# Altium project INA219_shield.PrjPcb
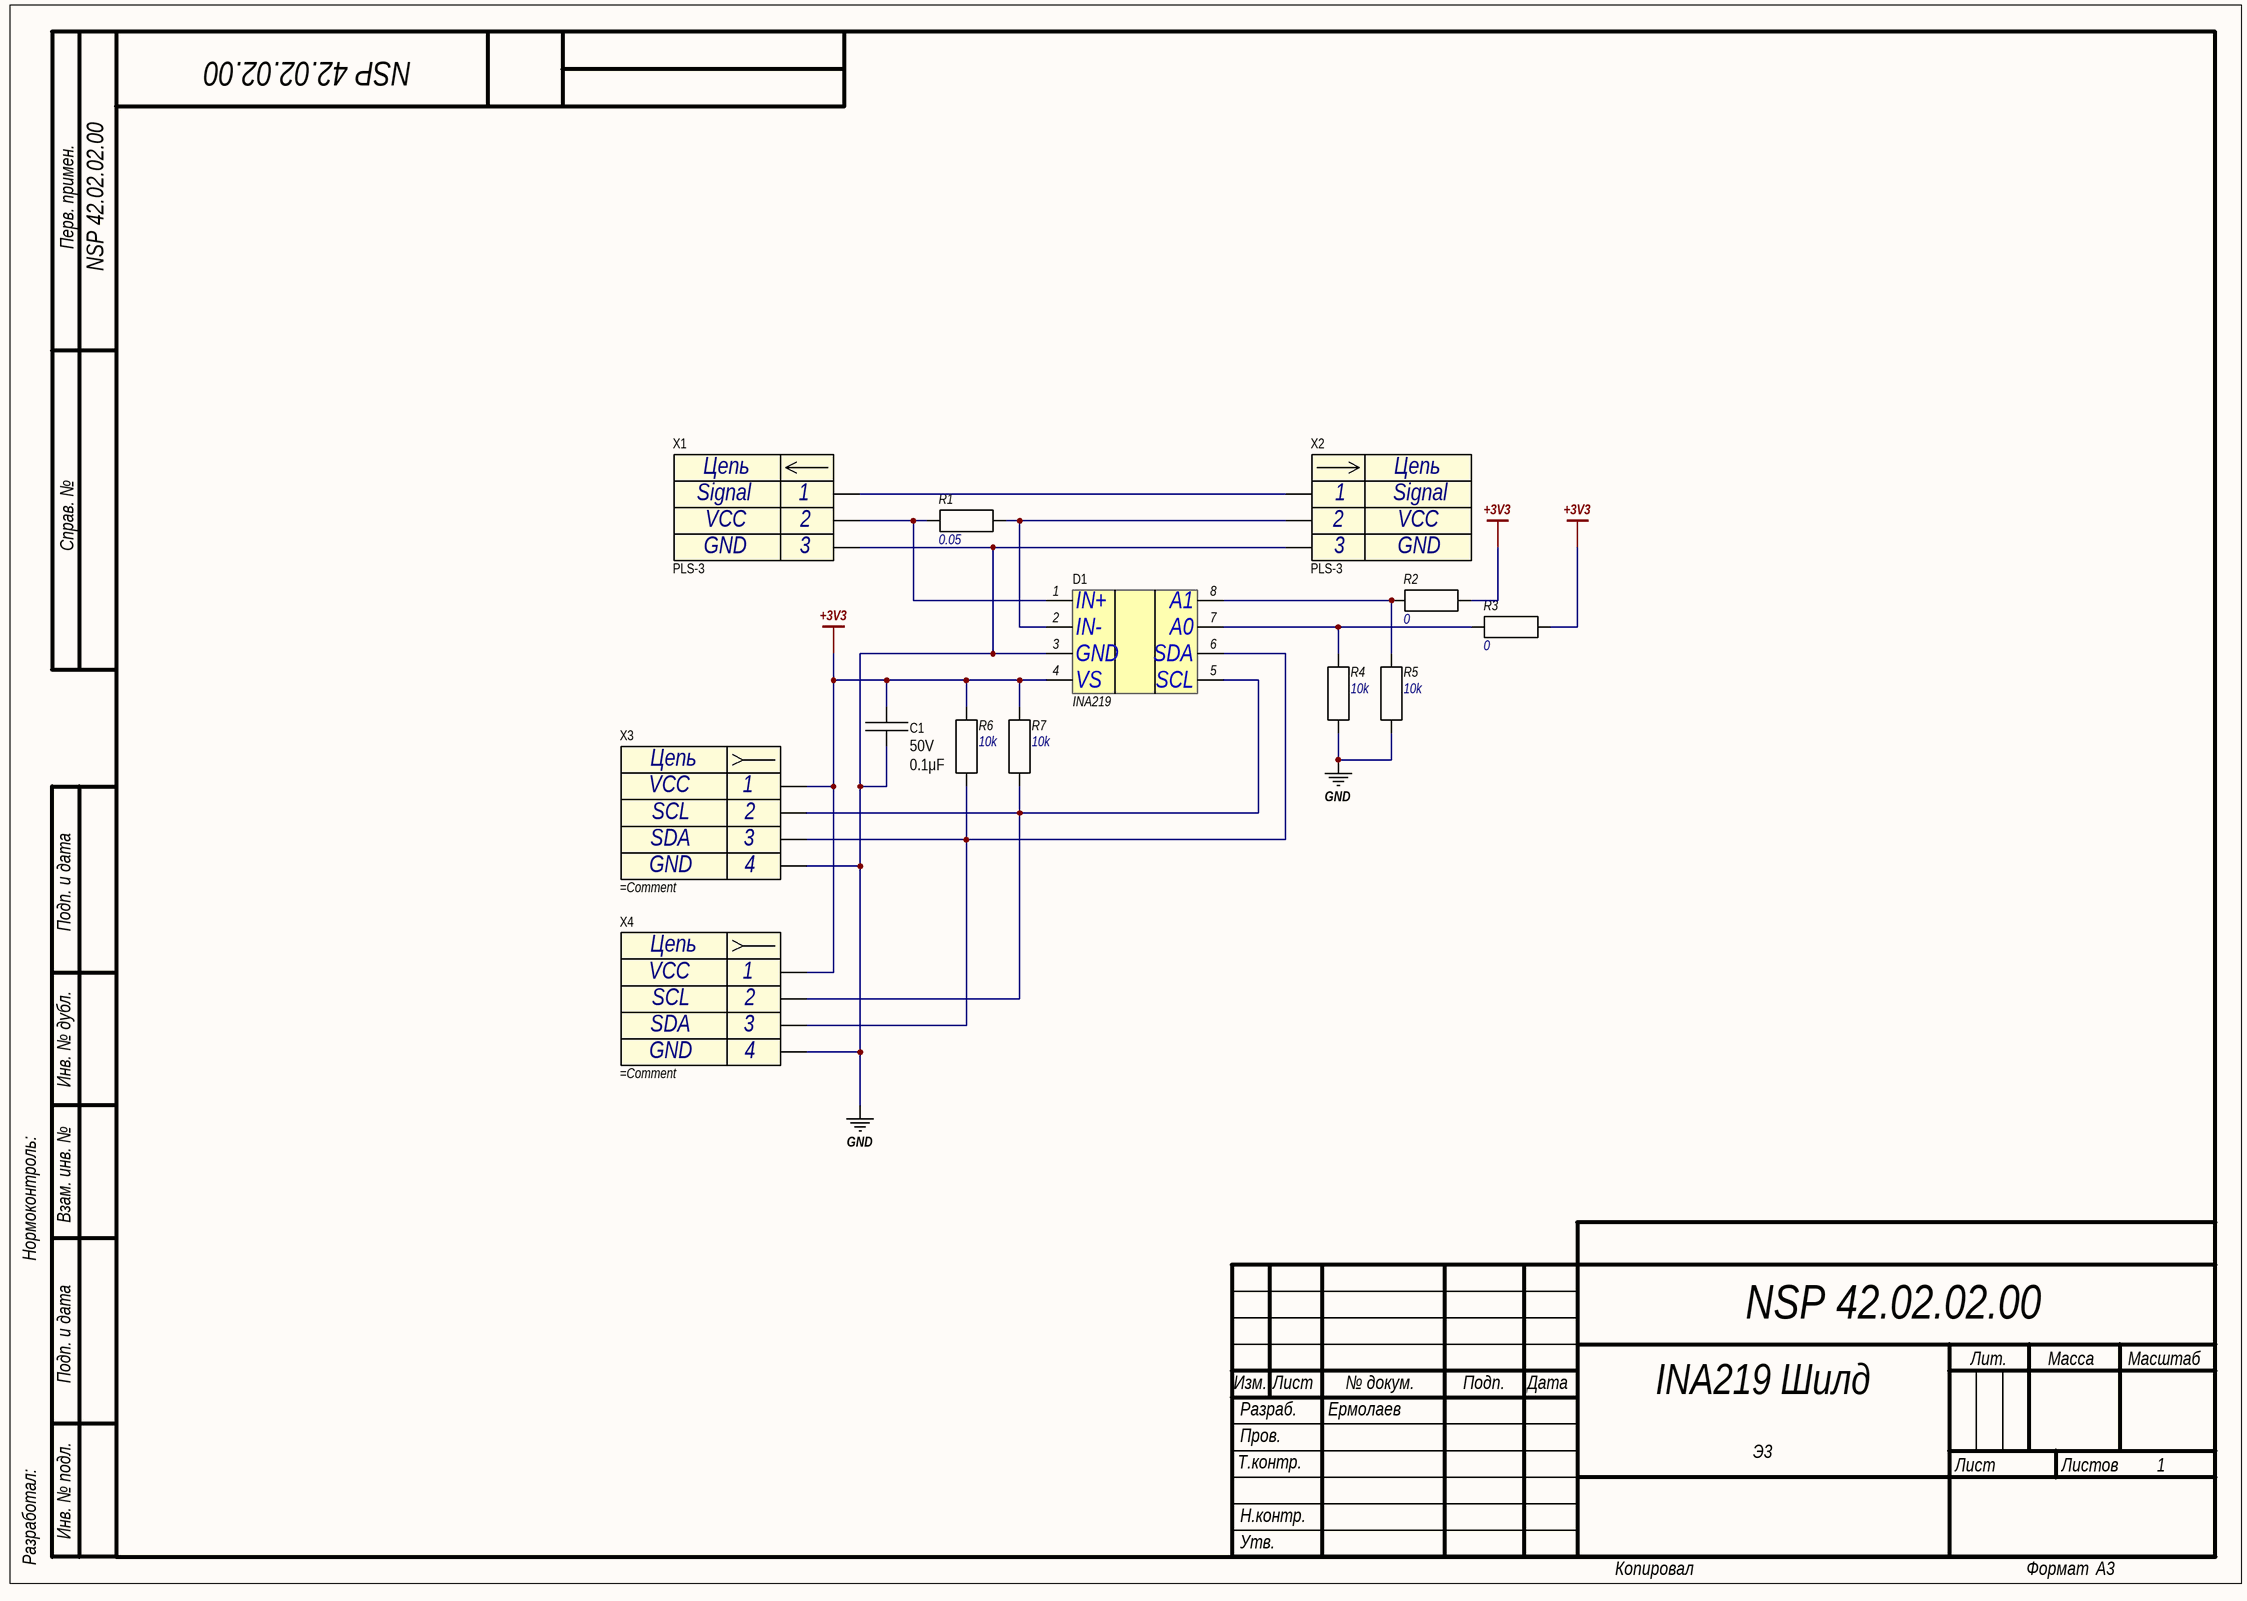
[diagram p0: Page1.SchDoc]
1 sheet, 13 parts. Net scope: global (net labels, ports and power ports of the same name join across sheets).
Board files: INA219_shield.PcbDoc, multi.PcbDoc

## Sheet Page1.SchDoc: INA219 Шилд
size 420 x 297 mm; DrawnBy: Ермолаев; DocumentNumber: NSP 42.02.02.00; SheetTotal: 1; DocumentType: Э3; Format: A3; ImagePath: NSP 42.02.02.00

### Parts
C1  value 0.1μF  Voltage: 50V  [CAP: 1206]
D1  INA219  [SOT23-8]
R1  0.05  [R2010]
R2  0  [R1206]
R3  0  [R1206]
R4  10k  [R1206]
R5  10k  [R1206]
R6  10k  [R1206]
R7  10k  [R1206]
X1  PLS-3  [PLS-3]
X2  PLS-3  [PLS-3]
X3  (no value)  [RJ-9_4p4c]
X4  (no value)  [RJ-9_4p4c]

### Nets
+3V3: C1.2 D1.4(VS) R2.2 R3.2 R6.2 R7.2 X3.1 X4.1
GND: C1.1 D1.3(GND) R4.1 R5.1 X1.3 X2.3 X3.4 X4.4
NetD1_1: D1.1(IN+) R1.1 X1.2
NetD1_2: D1.2(IN-) R1.2 X2.2
NetD1_5: D1.5(SCL) R7.1 X3.2 X4.2
NetD1_6: D1.6(SDA) R6.1 X3.3 X4.3
NetD1_7: D1.7(A0) R3.1 R4.2
NetD1_8: D1.8(A1) R2.1 R5.2
NetX1_1: X1.1 X2.1

### Notes on the sheet
- Перв. примен.
- Справ. №
- Подп. и дата
- Инв. № дубл.
- Нормоконтроль:
- Взам. инв. №
- Изм.
- Лист
- № докум.
- Подп.
- Дата
- Лит.
- Масса
- Масштаб
- Т.контр.
- Пров.
- Разраб.
- Листов
- Разработал:
- Инв. № подл.
- Н.контр.
- Утв.
- Копировал
- Формат
- (in symbol PLS-3) Цепь
- (in symbol rj-11) Цепь

### Library data of the parts
C1 = Ceramic_1206: Manufacturer: Yageo; PartNumber: CC1206KRX7R9BB104; ValueManufacturerPartNumber: Ceramic capacitor, 0.1μF, X7R, ±10%, 50V, 1206, -55...+125°C; TypeCapacitor: Ceramic capacitor; Tolerance: ±10%; TypeDielectric: X7R; Package: 1206; HelpURL: https://lcsc.com/product-detail/Multilayer-Ceramic-Capacitors-MLCC-SMD-SMT_100nF-104-10-50V_C82601.html; Temperature: -55...+125°C
D1 = INA219: Manufacture: Texas Instruments; Model: INA219AIDCNR; Part number: INA219AIDCNR; Help URL: https://lcsc.com/product-detail/PMIC-Current-Power-Monitors-Regulators_Texas-Instruments_INA219AIDCNR_Texas-Instruments-Texas-Instruments-INA219AIDCNR_C87469.html
R1 = Резистор: Manufacturing: YAGEO; Model: RL2010FK-070R05L; Help URL: https://lcsc.com/product-detail/Others_YAGEO-RL2010FK-070R05L_C309643.html; Case: 2010; Value: 0.05; Part number: RL2010FK-070R05L
R2 R3 = Резистор: Manufacturing: YAGEO; Model: RC1206FR-070RL; Help URL: https://lcsc.com/product-detail/_RC1206FR-070RL_C137394.html; Case: 1206; Value: 0; Part number: RC1206FR-070RL
R4-R7 = Резистор: Manufacturing: YAGEO; Model: RC1206FR-0710KL; Help URL: https://lcsc.com/product-detail/Chip-Resistor-Surface-Mount_10KR-1002-1_C132649.html; Case: 1206; Value: 10k; Part number: RC1206FR-0710KL
X1 X2 = PLS-3: Contact_1: Signal; Contact_2: VCC; Contact_3: GND; Model: *; Help URL: *
X3 X4 = rj-11: Contact_1: VCC; Contact_2: SCL; Contact_3: SDA; Contact_4: GND